# EAGLE design 12V24V led driver (EAGLE 5.11)
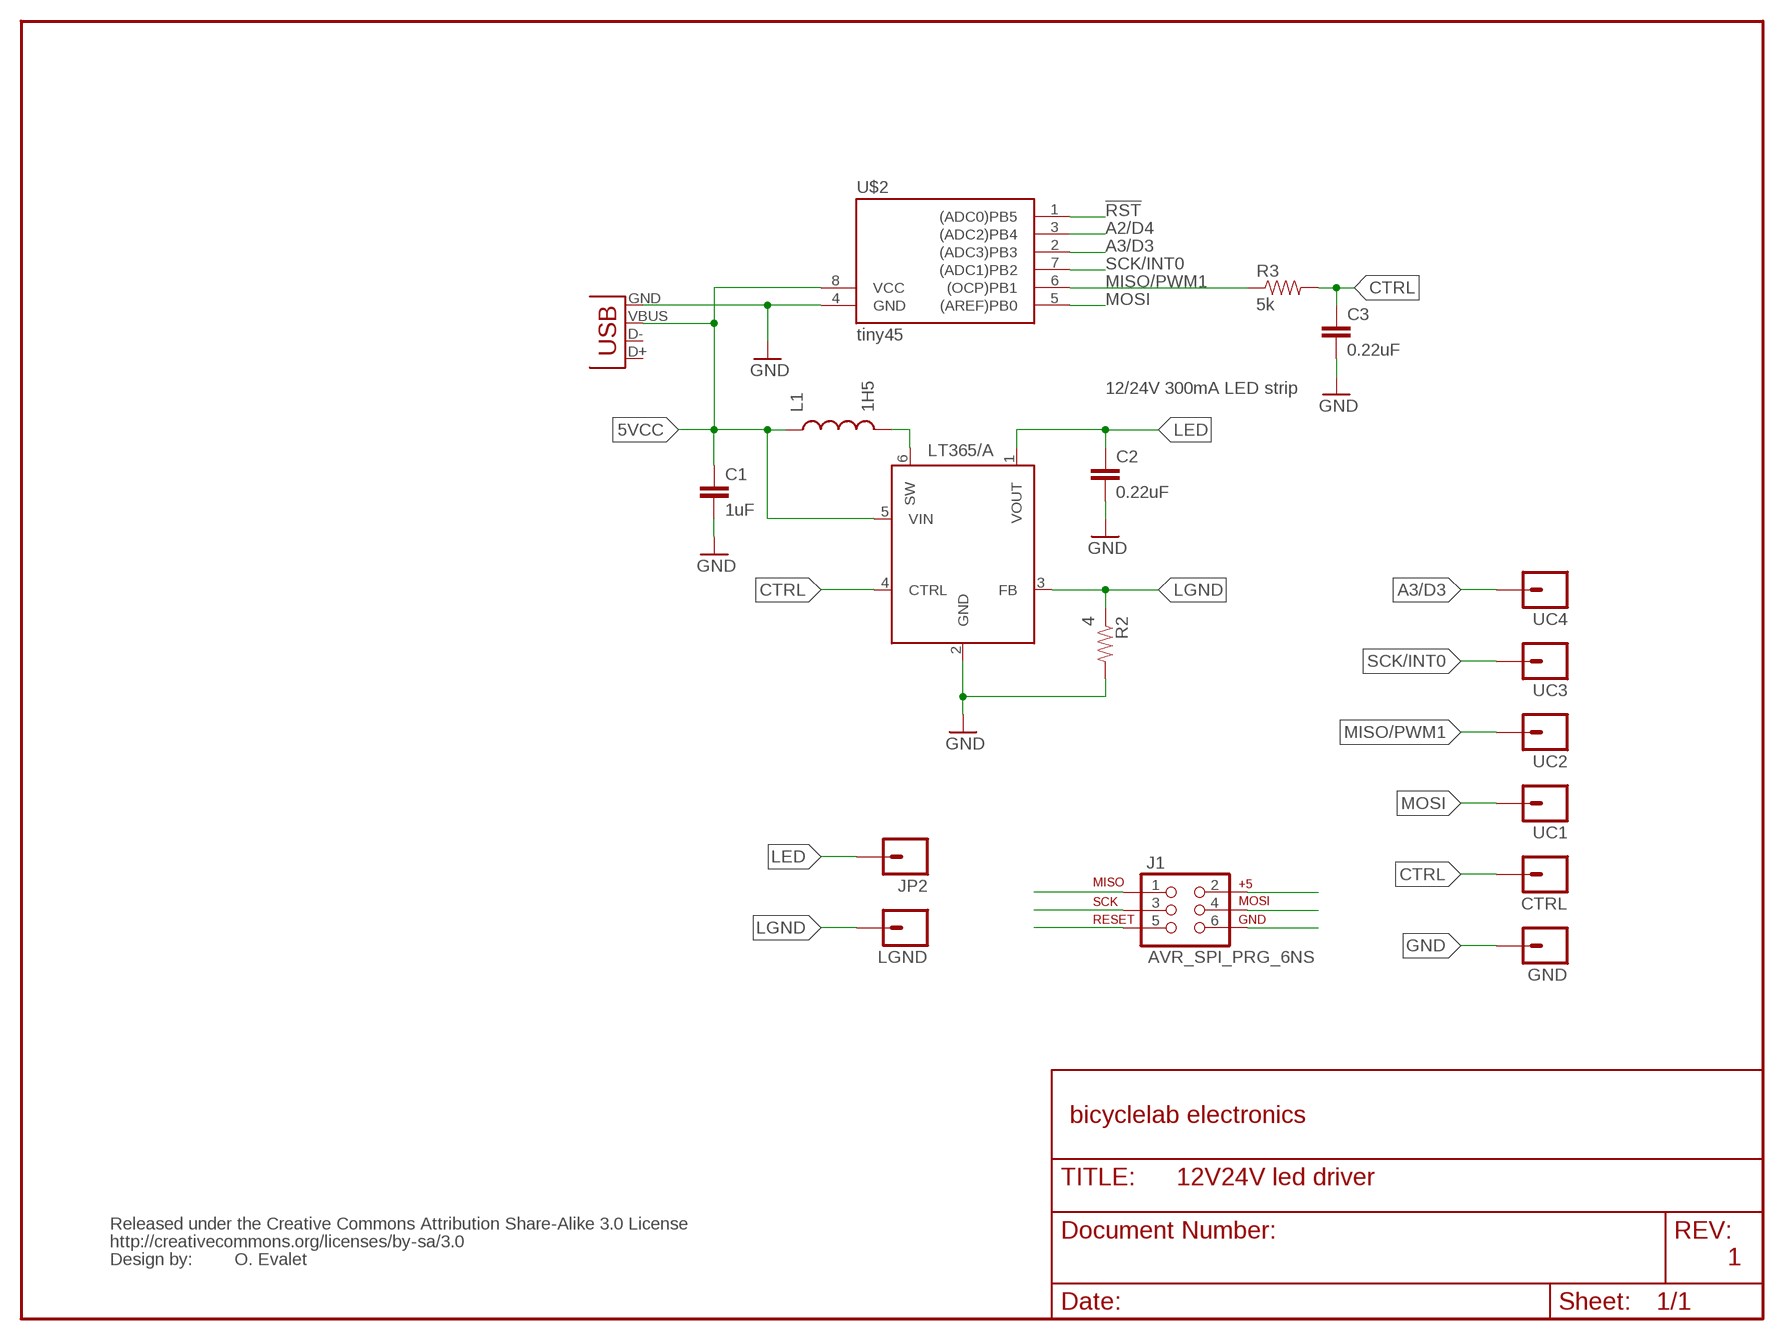
[diagram p0: schematic, sheet 1]

## Parts
C1  1uF  CAP0402-CAP  [0402-CAP]
C2  0.22uF  CAP0603-CAP  [0603-CAP]
C3  0.22uF  CAP0603-CAP  [0603-CAP]
CTRL  M01SMDNS  [1X01NS]
GND  M01SMDNS  [1X01NS]
J1  AVR_SPI_PRG_6NS  [2X3-NS]
JP2  M01PTH  [1X01]
L1  1H5  INDUCTOR0805  [0805]
LGND  M01PTH  [1X01]
R2  4  RESISTOR0402-RES  [0402-RES]
R3  5k  RESISTOR0402-RES  [0402-RES]
U$1  LT365  [TSOT23-6_DDC]
U$2  tiny45  TINY25/45/85-20SU  [SOIC8]
U$5  CREATIVE_COMMONS  [CREATIVE_COMMONS]
UC1  M01SMDNS  [1X01NS]
UC2  M01SMDNS  [1X01NS]
UC3  M01SMDNS  [1X01NS]
UC4  M01SMDNS  [1X01NS]
X1  USB-MICROB  [USB-MICROB]

## Nets
5VCC: C1.1 J1.2 L1.1 U$1.5(VIN) U$2.8(VCC) X1.VBUS
!RST: J1.5 U$2.1((ADC0)PB5)
A2/D4: U$2.3((ADC2)PB4)
A3/D3: U$2.2((ADC3)PB3) UC4.1
CTRL: C3.1 CTRL.1 R3.2 U$1.4(CTRL)
GND: C1.2 C2.2 C3.2 GND.1 J1.6 R2.2 U$1.2(GND) U$2.4(GND) X1.GND
LED: C2.1 JP2.1 U$1.1(VOUT)
LGND: LGND.1 R2.1 U$1.3(FB)
MISO/PWM1: J1.1 R3.1 U$2.6((OCP)PB1) UC2.1
MOSI: J1.4 U$2.5((AREF)PB0) UC1.1
N$3: L1.2 U$1.6(SW)
SCK/INT0: J1.3 U$2.7((ADC1)PB2) UC3.1
Unconnected: X1.D+ X1.D-

## Notes on the sheet
- 12/24V 300mA LED strip
- bicyclelab electronics
- O. Evalet | 1

## Library data of the parts
C1-C3 = SparkFun:CAP: Capacitor Standard 0603 ceramic capacitor, and 0.1" leaded capacitor.
CTRL GND JP2 LGND UC1-UC4 = SparkFun:M01: Header 1 Standard 1-pin 0.1" header. Use with straight break away headers (SKU : PRT-00116), right angle break away headers (PRT-00553), swiss pins (PRT-00743), machine pins (PRT-00117), and female headers (PRT-00115).
J1 = 0-SparkFun:AVR_SPI_PRG_6: AVR ISP 6 Pin This is the reduced ISP connector for AVR programming. Common on Arduino. This footprint will take up less PCB space and can be used with a 10-pin to 6-pin adapter such as SKU: BOB-08508
L1 = 0-SparkFun:INDUCTOR: Inductors Basic Inductor/Choke - 0603 and 1206. Footprints are not proven and vary greatly between part numbers.
R2 R3 = SparkFun:RESISTOR: Resistor Basic schematic elements and footprints for 0603, 1206, and PTH 1/10th watt (small) resistors.
U$1 = bicyclelab:LT365: 1.2MHz/2.4MHz White LED Drivers with Built-in Schottky in ThinSOT. The LT®3465/LT3465A are step-up DC/DC converters designed to drive up to six LEDs in series from a Li-Ion cell.
U$2 = 0-avr-7:TINY25/45/85
U$5 = SparkFun:CREATIVE_COMMONS
X1 = 0-SparkFun:USB: USB Connectors USB-B-PTH is fully proven SKU : PRT-00139 USB-miniB is fully proven SKU : PRT-00587 USB-A-PCB is untested. USB-A-H is throughly reviewed, but untested. Spark Fun Electronics SKU : PRT-00437 USB-B-SMT is throughly reviewed, but untested. Needs silkscreen touching up. USB-A-S has not been used/tested USB-MB-H has not been used/tested

## Net classes
0 default: width 0.203 mm
1 power: width 0.508 mm

## Board
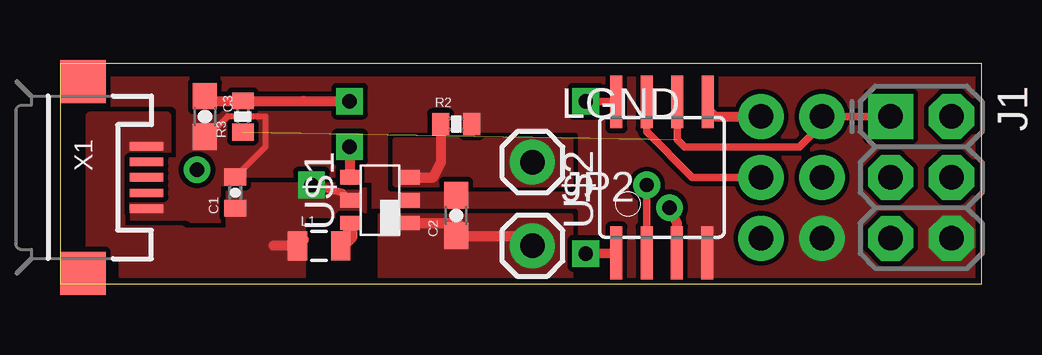
[diagram p1: board, top side]
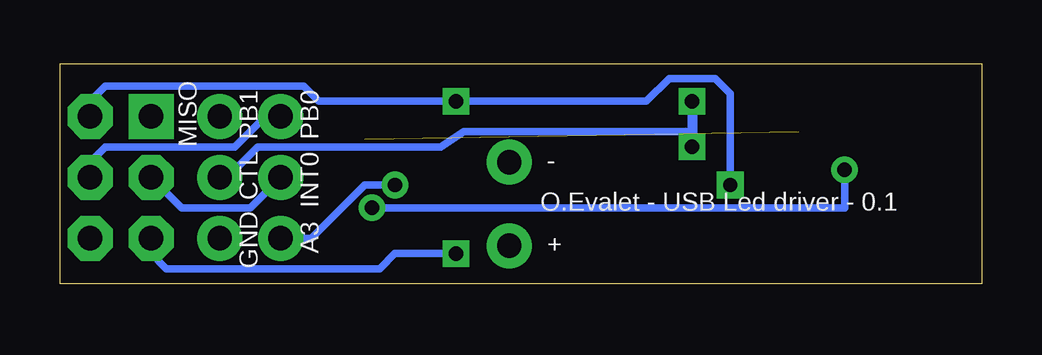
[diagram p2: board, bottom side, seen from below]

Size 38.41 x 9.2 mm. Coordinates in mm from the lower left corner, seen from the top.
Outline: 0,0 38.41,0 38.41,9.2 0,9.2 0,0
Copper layers (1*16): Top 0.035mm / dielectric 1.5mm / Bottom 0.035mm
Design rules "SparkFun": minimum track width 8mil, minimum drill 20mil, track to track 8mil, track to pad 8mil, pad to pad 8mil, via to via 8mil, smd to smd 8mil, copper to edge 10mil, drill to drill 8mil, minimum pad ring 12mil, minimum via ring 10mil, stop-mask expansion 4mil, vias tented up to drill 25mil, thermal gap 10mil

### Footprints (pad centres in the part's own frame; a part is rotated, then mirrored left to right if it is on the bottom)
0402-CAP = smd 0.7 x 0.9: 1 -0.65,0; 2 0.65,0
0603-CAP = smd 1.1 x 1: 1 -0.85,0; 2 0.85,0
1X01NS = drill 1.016 pad 1.88 round: 1 0,0
2X3-NS = drill 1.016 pad 1.88 square: 1 -2.54,-1.27 | drill 1.016 pad 1.88 octagon: 2 -2.54,1.27; 3 0,-1.27; 4 0,1.27; 5 2.54,-1.27; 6 2.54,1.27
1X01 = drill 1.016 pad 1.88 round: 1 0,0
0805 = smd 0.8 x 1.2: 1 -0.9,0; 2 0.9,0
0402-RES = smd 0.7 x 0.9: 1 -0.65,0; 2 0.65,0
TSOT23-6_DDC = smd 0.6 x 0.8: 1 -0.95,-1.25; 2 0,-1.25; 3 0.95,-1.25; 4 0.95,1.25; 5 0,1.25; 6 -0.95,1.25
SOIC8 = smd 0.5 x 2.2: 1 -1.905,-3.154; 2 -0.645,-3.154; 3 0.625,-3.154; 4 1.895,-3.154; 5 1.905,3.154; 6 0.635,3.154; 7 -0.635,3.154; 8 -1.905,3.154
USB-MICROB = smd 0.35 x 1.4: D+ 0,2.65; D- -0.65,2.65; GND 1.3,2.65; ID 0.65,2.65; VBUS -1.3,2.65 | smd 1.8 x 1.9: MT1 -4,0; MT2 4,0

### Placement (x,y rotation side)
C1  7.3,3.81 90 top
C2  16.51,2.86 90 top
C3  6.03,6.99 270 top
CTRL  31.75,4.45 90 top
GND  31.75,1.91 180 top
J1  35.88,4.45 270 top
JP2  19.68,1.59 0 top
L1  10.79,1.59 0 top
LGND  19.68,5.08 0 top
R2  16.51,6.67 0 top
R3  7.62,6.99 90 top
U$1  13.34,3.49 90 top
U$2  25.08,4.45 0 top
U$5  -7.62,-10.16 0 top  (outside the outline)
UC1  29.21,6.99 0 top
UC2  31.75,6.99 0 top
UC3  29.21,4.45 0 top
UC4  29.21,1.91 270 top
X1  0.95,4.45 270 top

### Tracks (layer width: path | path; a pad name or v marks a point on that pad's centre or on a via)
5VCC  (via drill 0.6)
  Top 0.305: U$2.8 21.93,7.6 v21.91,7.62 | v10.48,4.13 11.77,3.81 U$1.5
  Top 0.406: 10.16,1.85 L1.1 8.89,1.59
  Bottom 0.305: v10.48,4.13 10.48,7.94 11.11,8.57 13.02,8.57 13.97,7.62 v21.91,7.62 27.62,7.62 28.26,8.25 36.51,8.25 37.15,7.62 J1.2
  pour Top (rank 2, no thermals): 2.54,0.32 10.16,0.32 10.16,2.86 12.7,2.86 12.7,4.13 6.99,4.13 6.99,2.22 2.54,2.22
  pour Top (no thermals): 4.45,5.4 4.45,6.99 1.27,6.99 1.27,1.27 5.08,1.27 5.08,2.22 2.54,2.22 2.54,5.4
!RST  (via drill 0.6)
  Top 0.406: v21.91,1.27 U$2.1
  Bottom 0.305: v21.91,1.27 24.45,1.27 25.08,0.64 33.97,0.64 34.61,1.27 J1.5
A2/D4  (via drill 0.6)
  Top 0.305: 6.03,4.75 v5.71,4.76
  Top 0.406: U$2.3 25.71,2.53 v25.4,3.18
  Bottom 0.305: v5.71,4.76 5.71,3.18 v25.4,3.18
A3/D3  (via drill 0.6)
  Top 0.305: U$2.2 24.44,4.12 v24.45,4.13
  Bottom 0.305: v24.45,4.13 25.72,4.13 27.94,1.91 UC4.1
CTRL  (via drill 0.6)
  Top 0.406: v12.06,5.71 12.06,4.46 U$1.4 | C3.1 6.23,7.63 R3.2 10.14,7.63 10.16,7.62 v12.06,7.62
  Bottom 0.305: 12.06,6.35 21.59,6.35 22.54,5.71 30.16,5.71 31.43,4.45 CTRL.1
  Bottom 0.406: v12.06,7.62 12.06,6.35 v12.06,5.71
GND
  Top 0.254: C3.2 6.13,6.13 6.99,6.99 8.57,6.99 8.57,5.73 C1.2
  pour Top (rank 4, no thermals): 0,8.57 38.42,8.57 38.42,-0.32 0,-0.32
LED
  Top 0.406: U$1.1 16.61,2.54 C2.1 19.27,2.01 JP2.1
  pour Top (no thermals): 21.27,-0.32 13.34,-0.32 13.34,2.86 21.27,2.86
LGND
  Top 0.406: U$1.3 15.55,4.44 15.88,5.08 15.88,6.65 R2.1
  pour Top (no thermals): 21.27,4.13 13.97,4.13 13.97,6.03 21.27,6.03
MISO/PWM1  (1 unrouted)
  Top 0.305: U$2.6 25.72,6.03 26.04,5.71 30.8,5.71 31.75,6.67 UC2.1 J1.1
MOSI
  Top 0.406: U$2.5 26.99,7.3 27.3,6.99 UC1.1
  Bottom 0.305: UC1.1 29.84,6.99 31.11,5.71 36.51,5.71 37.15,5.08 J1.4
N$3
  Top 0.61: U$1.6 12.09,1.98 L1.2
SCK/INT0
  Top 0.305: UC3.1 26.35,4.45 24.45,6.35 U$2.7
  Bottom 0.305: UC3.1 30.48,3.18 33.34,3.18 J1.3

### Text on the board
bPlace: PB0 | PB1 | MISO | - | O.Evalet - USB Led driver - 0.1 | CTL | INT0 | + | A3 | GND
tValues: O.Evalet